# EAGLE design nucleo-block3-a-1 (EAGLE 9.6.2)
AUTHOR: Balazs Racz; DRAWING_TITLE: MEB Schalterwerk Projekt; LICENSE: Licensed by the Solderpad Hardware License V2.0; REVIEWER: n/a; REVISION: A2; YEAR: 2023
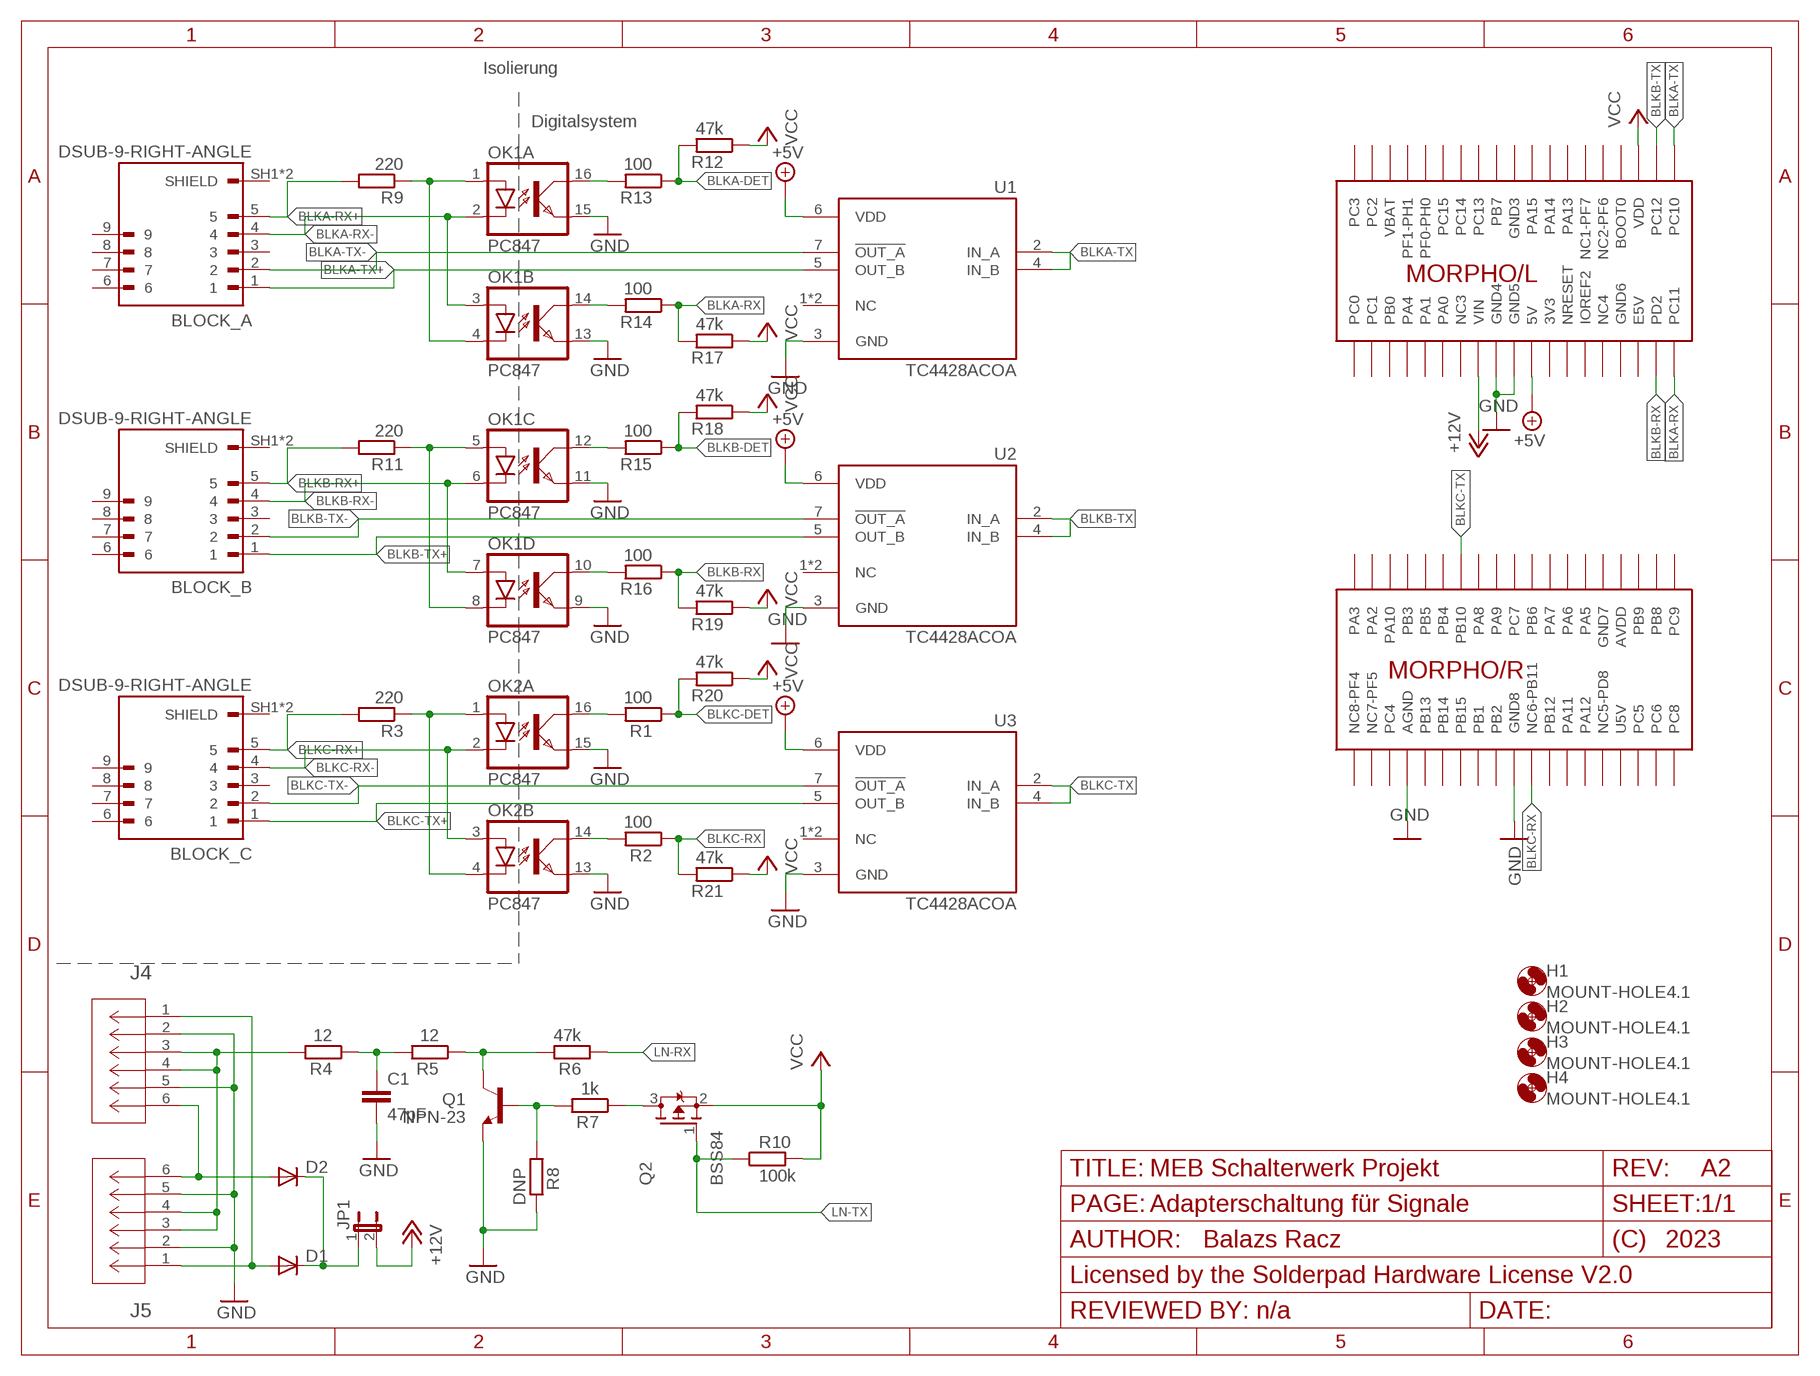
[diagram p0: schematic, sheet 1]
FRAME1 (FRAME_A_L): PAGE: Input ports
FRAME2 (FRAME_A_L): PAGE: Adapterschaltung für Signale

## Parts
BLOCK_A  DSUB-9-RIGHT-ANGLE  [ASSMANN_A-DS_09_A_KG-T2S]
BLOCK_B  DSUB-9-RIGHT-ANGLE  [ASSMANN_A-DS_09_A_KG-T2S]
BLOCK_C  DSUB-9-RIGHT-ANGLE  [ASSMANN_A-DS_09_A_KG-T2S]
C1  47pF  C-EUC0805  [C0805]
D1  DIODEDO-214AA-NODOC  [DO214AA-NODOC]
D2  DIODEDO-214AA-NODOC  [DO214AA-NODOC]
G1  NUCLEO_64_GENERIC  [NUCLEO_BRD_BASE64]
H1  MOUNT-HOLE4.1  [4,1]
H2  MOUNT-HOLE4.1  [4,1]
H3  MOUNT-HOLE4.1  [4,1]
H4  MOUNT-HOLE4.1  [4,1]
J4  MODJACK6P6C-MJ3245-66-0CONN_MJ3245-66-0_GCT  [CONN_MJ3245-66-0_GCT]
J5  MODJACK6P6C-MJ3245-66-0CONN_MJ3245-66-0_GCT  [CONN_MJ3245-66-0_GCT]
JP1  JP1E  [JP1]
OK1  PC847  [DIL16]
OK2  PC847  [DIL16]
Q1  NPN-23  [SOT23]
Q2  BSS84  [SOT23-PCH]
R1  100  R-EU_R0805  [R0805]
R2  100  R-EU_R0805  [R0805]
R3  220  R-EU_R0805  [R0805]
R4  12  R-EU_R0805  [R0805]
R5  12  R-EU_R0805  [R0805]
R6  47k  R-EU_R0805  [R0805]
R7  1k  R-EU_R0805  [R0805]
R8  DNP  R-EU_R0805  [R0805]
R9  220  R-EU_R0805  [R0805]
R10  100k  R-EU_R0805  [R0805]
R11  220  R-EU_R0805  [R0805]
R12  47k  R-EU_R0805  [R0805]
R13  100  R-EU_R0805  [R0805]
R14  100  R-EU_R0805  [R0805]
R15  100  R-EU_R0805  [R0805]
R16  100  R-EU_R0805  [R0805]
R17  47k  R-EU_R0805  [R0805]
R18  47k  R-EU_R0805  [R0805]
R19  47k  R-EU_R0805  [R0805]
R20  47k  R-EU_R0805  [R0805]
R21  47k  R-EU_R0805  [R0805]
U1  TC4428ACOA  [SOIC127P600X175-8N]
U2  TC4428ACOA  [SOIC127P600X175-8N]
U3  TC4428ACOA  [SOIC127P600X175-8N]

## Nets
+5V: G1.5V2(5V) U1.6(VDD) U2.6(VDD) U3.6(VDD)
+12V: G1.VIN2(VIN) JP1.2
BLKA-DET: R12.2 R13.1
BLKA-RX: G1.PC11 R14.1 R17.2
BLKA-RX+: BLOCK_A.5 R9.2
BLKA-RX-: BLOCK_A.4 OK1.2(A:C) OK1.3(B:A)
BLKA-TX: G1.PC10 U1.2(IN_A) U1.4(IN_B)
BLKA-TX+: BLOCK_A.1 U1.5(OUT_B)
BLKA-TX-: BLOCK_A.2 U1.7(!OUT_A)
BLKB-DET: R15.1 R18.2
BLKB-RX: G1.PD2 R16.1 R19.2
BLKB-RX+: BLOCK_B.5 R11.2
BLKB-RX-: BLOCK_B.4 OK1.6(C:C) OK1.7(D:A)
BLKB-TX: G1.PC12 U2.2(IN_A) U2.4(IN_B)
BLKB-TX+: BLOCK_B.1 U2.5(OUT_B)
BLKB-TX-: BLOCK_B.2 U2.7(!OUT_A)
BLKC-DET: R1.1 R20.2
BLKC-RX: G1.NC6-PB11 R2.1 R21.2
BLKC-RX+: BLOCK_C.5 R3.2
BLKC-RX-: BLOCK_C.4 OK2.2(A:C) OK2.3(B:A)
BLKC-TX: G1.PB10 U3.2(IN_A) U3.4(IN_B)
BLKC-TX+: BLOCK_C.1 U3.5(OUT_B)
BLKC-TX-: BLOCK_C.2 U3.7(!OUT_A)
GND: C1.2 G1.AGND G1.GND4 G1.GND5 G1.GND8 J4.2 J4.5 J5.2 J5.5 OK1.9(D:EMIT) OK1.11(C:EMIT) OK1.13(B:EMIT) OK1.15(A:EMIT) OK2.13(B:EMIT) OK2.15(A:EMIT) Q1.2(E) R8.2 U1.3(GND) U2.3(GND) U3.3(GND)
LN-RX: R6.1
LN-TX: Q2.1(G) R10.1
N$1: OK2.1(A:A) OK2.4(B:C) R3.1
N$2: OK2.16(A:COL) R1.2
N$3: OK2.14(B:COL) R2.2
N$4: D2.A J4.6 J5.6
N$5: C1.1 R4.1 R5.2
N$6: D1.A J4.1 J5.1
N$7: J4.3 J4.4 J5.3 J5.4 R4.2
N$8: D1.C D2.C JP1.1
N$9: Q1.3(C) R5.1 R6.2
N$10: Q2.3(D) R7.1
N$11: Q1.1(B) R7.2 R8.1
N$31: OK1.1(A:A) OK1.4(B:C) R9.1
N$35: OK1.5(C:A) OK1.8(D:C) R11.1
N$41: OK1.16(A:COL) R13.2
N$42: OK1.14(B:COL) R14.2
N$43: OK1.12(C:COL) R15.2
N$44: OK1.10(D:COL) R16.2
VCC: G1.VDD Q2.2(S) R10.2 R12.1 R17.1 R18.1 R19.1 R20.1 R21.1
Unconnected: BLOCK_A.3 BLOCK_A.6 BLOCK_A.7 BLOCK_A.8 BLOCK_A.9 BLOCK_A.SH1(SHIELD) BLOCK_A.SH2(SHIELD) BLOCK_B.3 BLOCK_B.6 BLOCK_B.7 BLOCK_B.8 BLOCK_B.9 BLOCK_B.SH1(SHIELD) BLOCK_B.SH2(SHIELD) BLOCK_C.3 BLOCK_C.6 BLOCK_C.7 BLOCK_C.8 BLOCK_C.9 BLOCK_C.SH1(SHIELD) BLOCK_C.SH2(SHIELD) G1.BOOT0 G1.IOREF2 G1.NC1-PF7 G1.NC2-PF6 G1.NC3 G1.NC4 G1.NC5-PD8 G1.NC7-PF5 G1.NC8-PF4 G1.NRESET G1.PA0 G1.PA1 G1.PA2 G1.PA3 G1.PA4 G1.PA5 G1.PA6 G1.PA7 G1.PA8 G1.PA9 G1.PA10 G1.PA11 G1.PA12 G1.PA13 G1.PA14 G1.PA15 G1.PB0 G1.PB1 G1.PB2 G1.PB3 G1.PB4 G1.PB5 G1.PB6 G1.PB7 G1.PB8 G1.PB9 G1.PB12 G1.PB13 G1.PB14 G1.PB15 G1.PC0 G1.PC1 G1.PC2 G1.PC3 G1.PC4 G1.PC5 G1.PC6 G1.PC7 G1.PC8 G1.PC9 G1.PC13 G1.PC14 G1.PC15 G1.PF0-PH0 G1.PF1-PH1 OK2.5(C:A) OK2.6(C:C) OK2.7(D:A) OK2.8(D:C) OK2.9(D:EMIT) OK2.10(D:COL) OK2.11(C:EMIT) OK2.12(C:COL) U1.1(NC) U1.8(NC) U2.1(NC) U2.8(NC) U3.1(NC) U3.8(NC)

## Notes on the sheet
- Isolierung
- Digitalsystem

## Power pins joined to a net without a drawn wire
3V3: G1.3V3
AVDD: G1.AVDD
E5V: G1.E5V
GND3: G1.GND3
GND6: G1.GND6
GND7: G1.GND7
U5V: G1.U5V
VBAT: G1.VBAT

## Library data of the parts
BLOCK_A BLOCK_B BLOCK_C = eagleparts:DSUB-9-RIGHT-ANGLE: A-DS_09_A_KG-T2S Female: digikey AE10921-ND Male: digikey AE10968-ND; MANUFACTURER: Assmann WSW Components; MAXIMUM_PACKAGE_HEIGHT: 12.8mm; PARTREV: 10; STANDARD: Manufacturer recommendations
C1 = rcl:C-EU: CAPACITOR, European symbol; SPICEPREFIX: C
D1 D2 = trainlib:DIODE
G1 = eagleparts:NUCLEO_64_GENERIC
H1-H4 = holes:MOUNT-HOLE: MOUNTING HOLE with drill center marker
J4 J5 = eagleparts:MODJACK6P6C-MJ3245-66-0: 6p6c modular jack digikey: 2073-MJ3245-66-0-ND; COPYRIGHT: Copyright (C) 2024 Ultra Librarian. All rights reserved.; MANUFACTURER_PART_NUMBER: MJ3245-66-0; MFR_NAME: Global Connector Technology; TYPE: Modular Connector Jacks
JP1 = jumper:JP1E: JUMPER
OK1 OK2 = optocoupler:PC847: SHARP OPTO COUPLER; OC_FARNELL: 9707735; OC_NEWARK: unknown
Q1 = eagleparts:NPN-23
Q2 = eagleparts:BSS84: P-CHANNEL MOS FET
R1-R21 = rcl:R-EU_: RESISTOR, European symbol; SPICEPREFIX: R
U1-U3 = eagleparts:TC4428ACOA: Low-Side Gate Driver IC Inverting, Non-Inverting 8-SOIC; MANUFACTURER: Microchip; MAXIMUM_PACKAGE_HEIGHT: 1.75 mm; PARTREV: J; STANDARD: IPC 7351B

## Board
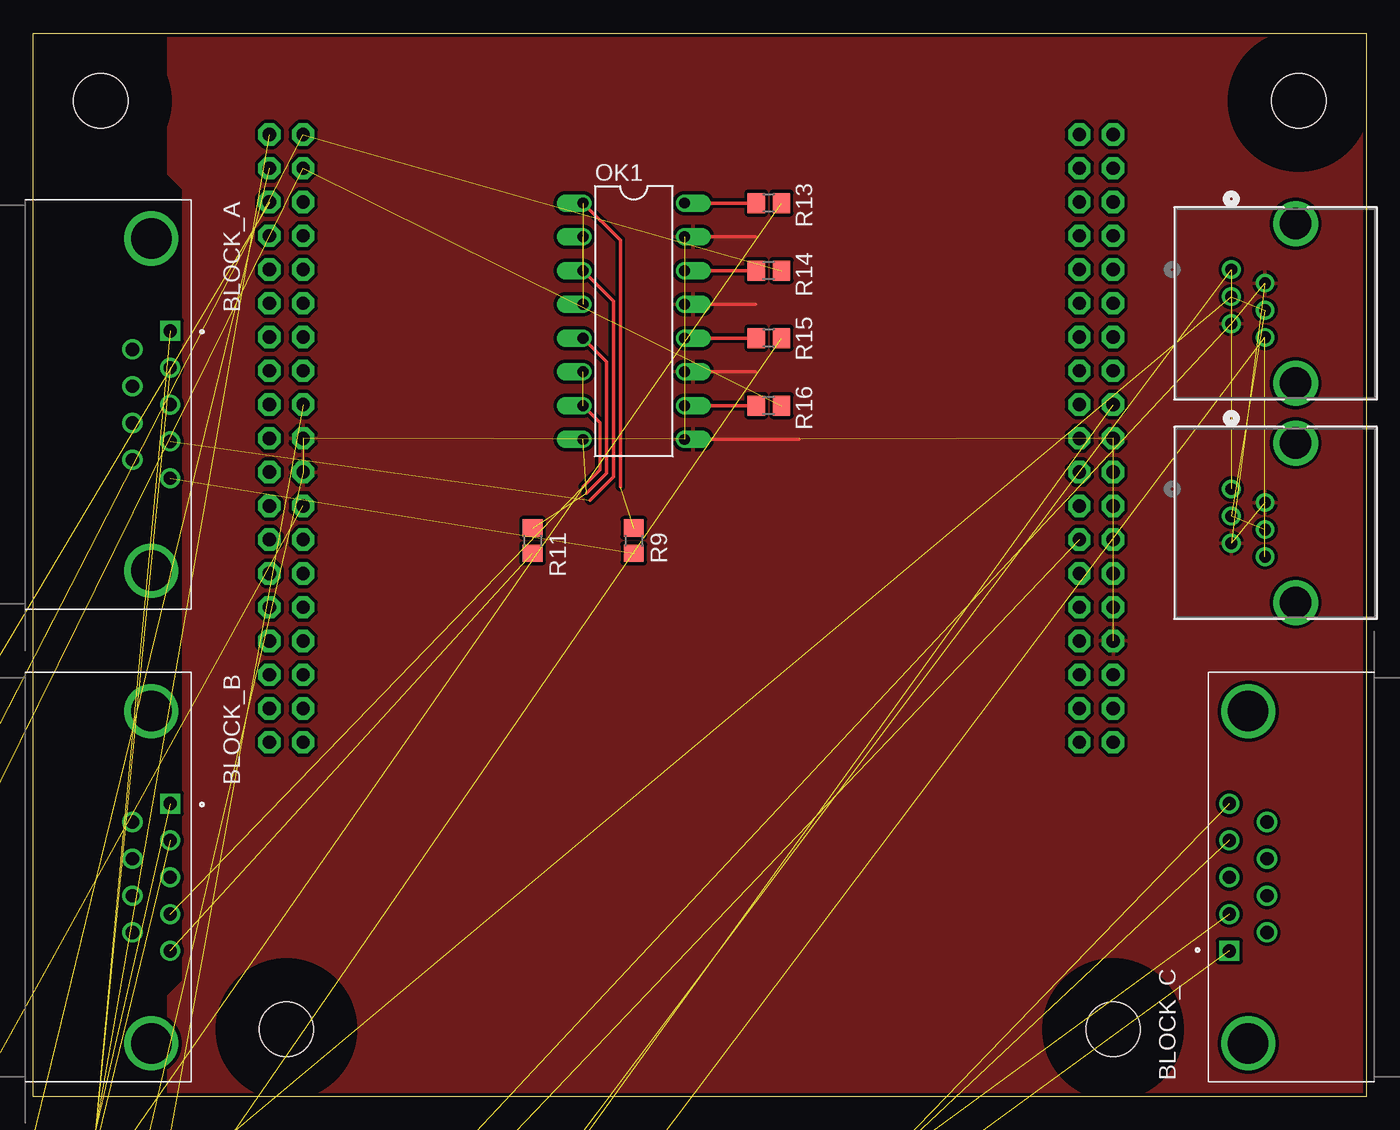
[diagram p1: board, top side]
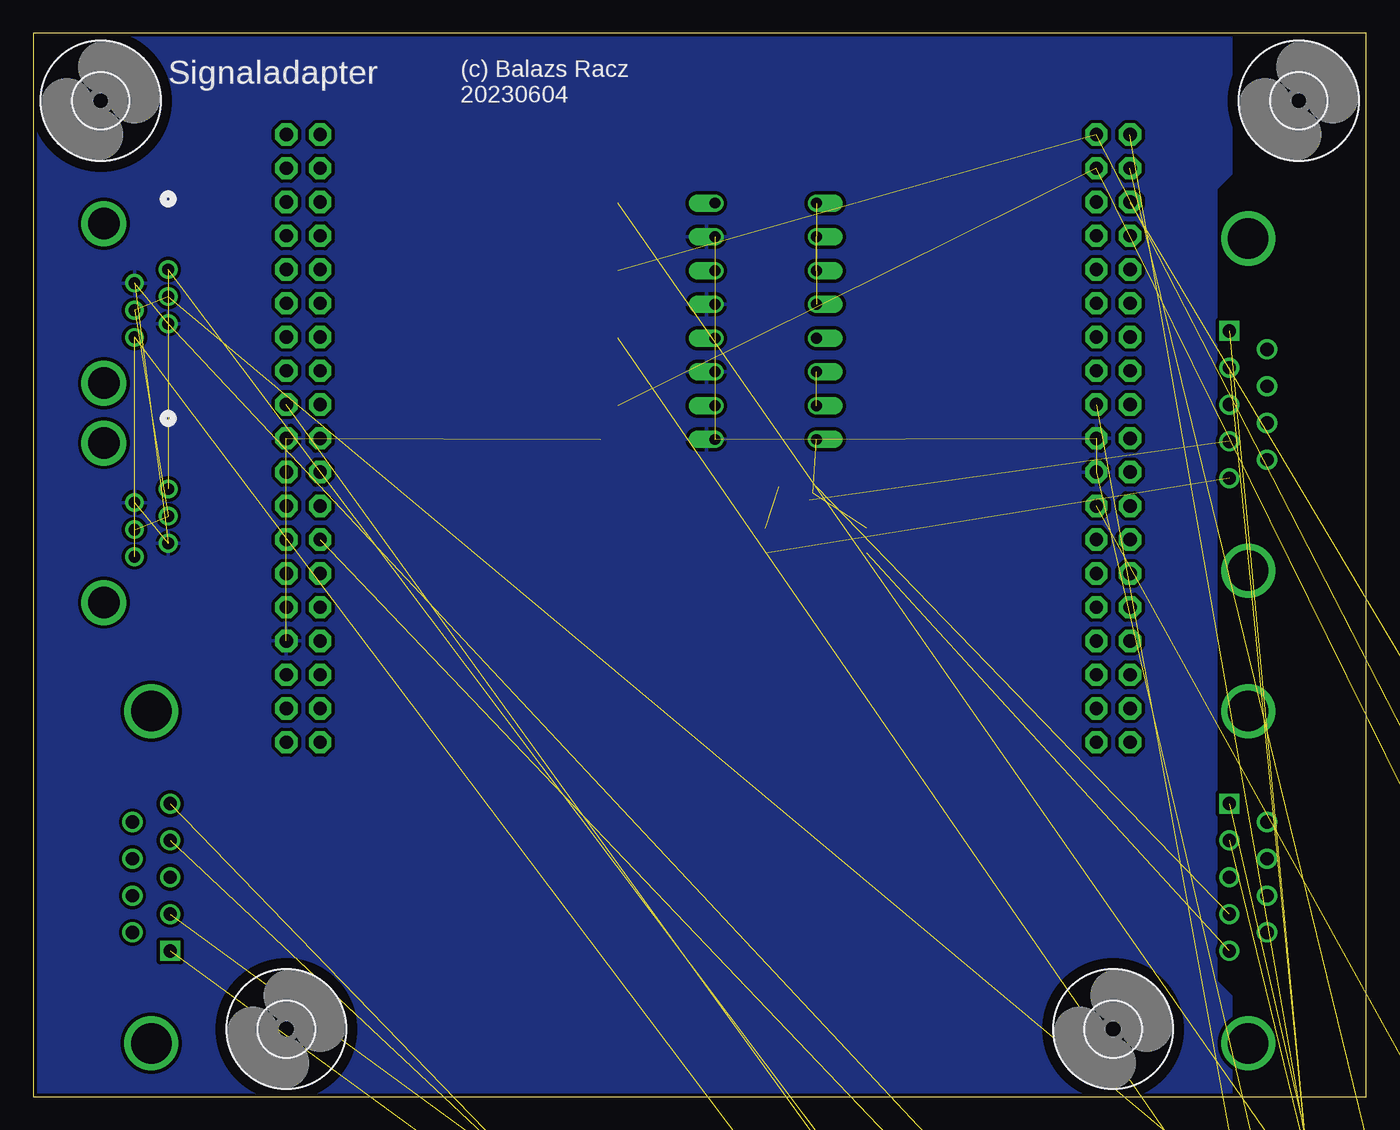
[diagram p2: board, bottom side, seen from below]

Size 100.33 x 80.01 mm. Coordinates in mm from the lower left corner, seen from the top.
Outline: 100.33,0 0,0 0,80.01 100.33,80 100.33,0
Copper layers (1*16): Top 0.035mm / dielectric 1.5mm / Bottom 0.035mm
Design rules "SeeedStudio_2layer_DRU_no_angle_20140221": minimum track width 6mil, minimum drill 12mil, track to track 6mil, track to pad 6mil, pad to pad 6mil, via to via 6mil, smd to smd 0mil, copper to edge 10mil, drill to drill 10mil, minimum pad ring 10mil, minimum via ring 6mil, stop-mask expansion 2mil, vias tented up to drill 100mil, thermal gap 10mil

### Footprints (pad centres in the part's own frame; a part is rotated, then mirrored left to right if it is on the bottom)
ASSMANN_A-DS_09_A_KG-T2S = drill 1 square: 1 -5.54,1.42 | drill 1: 2 -2.77,1.42; 3 0,1.42; 4 2.77,1.42; 5 5.54,1.42; 6 -4.155,-1.42; 7 -1.385,-1.42; 8 1.385,-1.42; 9 4.155,-1.42 | drill 3.05: SH1 -12.495,0; SH2 12.495,0
C0805 = smd 1.3 x 1.5: 1 -0.95,0; 2 0.95,0
DO214AA-NODOC = smd 1.8 x 2.2: A 2.55,0; C -2.55,0
NUCLEO_BRD_BASE64 = drill 1 pad 1.676 octagon: 3V3 2.54,27.94; 5V2 2.54,25.4; AGND 63.5,7.62; AVDD 60.96,38.1; BOOT0 0,38.1; E5V 2.54,40.64; GND3 0,22.86; GND4 2.54,20.32; GND5 2.54,22.86; GND6 2.54,38.1; GND7 60.96,35.56; GND8 63.5,22.86; IOREF2 2.54,33.02; NC1-PF7 0,33.02; NC2-PF6 0,35.56; NC3 2.54,15.24; NC4 2.54,35.56; NC5-PD8 63.5,35.56; NC6-PB11 63.5,25.4; NC7-PF5 63.5,2.54; NC8-PF4 63.5,0; NRESET 2.54,30.48; PA0 2.54,12.7; PA1 2.54,10.16; PA2 60.96,2.54; PA3 60.96,0; PA4 2.54,7.62; PA5 60.96,33.02; PA6 60.96,30.48; PA7 60.96,27.94; PA8 60.96,17.78; PA9 60.96,20.32; PA10 60.96,5.08; PA11 63.5,30.48; PA12 63.5,33.02; PA13 0,30.48; PA14 0,27.94; PA15 0,25.4; PB0 2.54,5.08; PB1 63.5,17.78; PB2 63.5,20.32; PB3 60.96,7.62; PB4 60.96,12.7; PB5 60.96,10.16; PB6 60.96,25.4; PB7 0,20.32; PB8 60.96,43.18; PB9 60.96,40.64; PB10 60.96,15.24; PB12 63.5,27.94; PB13 63.5,10.16; PB14 63.5,12.7; PB15 63.5,15.24; PC0 2.54,0; PC1 2.54,2.54; PC2 0,2.54; PC3 0,0; PC4 63.5,5.08; PC5 63.5,40.64; PC6 63.5,43.18; PC7 60.96,22.86; PC8 63.5,45.72; PC9 60.96,45.72; PC10 0,45.72; PC11 2.54,45.72; PC12 0,43.18; PC13 0,17.78; PC14 0,15.24; PC15 0,12.7; PD2 2.54,43.18; PF0-PH0 0,10.16; PF1-PH1 0,7.62; U5V 63.5,38.1; VBAT 0,5.08; VDD 0,40.64; VIN2 2.54,17.78
4,1 = hole 4.1: 0,0
CONN_MJ3245-66-0_GCT = drill 0.889 pad 1.397: 1 0,0; 2 -1.02,-2.54; 3 -2.04,0; 4 -3.06,-2.54; 5 -4.08,0; 6 -5.1,-2.54 | drill 2.362 pad 2.362: 7 -8.55,-4.84; 8 3.45,-4.84
JP1 = drill 0.914 long: 1 0,-1.27; 2 0,1.27
DIL16 = drill 0.813 offset: 1 -8.89,-3.81; 2 -6.35,-3.81; 3 -3.81,-3.81; 4 -1.27,-3.81; 5 1.27,-3.81; 6 3.81,-3.81; 7 6.35,-3.81; 8 8.89,-3.81; 9 8.89,3.81; 10 6.35,3.81; 11 3.81,3.81; 12 1.27,3.81; 13 -1.27,3.81; 14 -3.81,3.81; 15 -6.35,3.81; 16 -8.89,3.81
SOT23 = smd 1 x 1.4: 1 -0.95,-1.1; 2 0.95,-1.1; 3 0,1.1
SOT23-PCH = smd 1 x 1.4: 1 -0.95,-1.1; 2 0.95,-1.1; 3 0,1.1
R0805 = smd 1.3 x 1.5: 1 -0.95,0; 2 0.95,0
SOIC127P600X175-8N = smd 1.9 x 0.6: 1 -2.455,1.905; 2 -2.455,0.635; 3 -2.455,-0.635; 4 -2.455,-1.905; 5 2.455,-1.905; 6 2.455,-0.635; 7 2.455,0.635; 8 2.455,1.905

### Placement (x,y rotation side)
BLOCK_A  8.89,52.07 270 top
BLOCK_B  8.89,16.51 270 top
BLOCK_C  91.44,16.51 90 top
C1  -104.14,-114.3 0 top  (outside the outline)
D1  -109.22,-199.39 0 top  (outside the outline)
D2  -109.22,-207.01 0 top  (outside the outline)
G1  17.78,26.67 0 top
H1  5.08,74.93 0 bottom
H2  19.05,5.08 0 bottom
H3  81.28,5.08 0 bottom
H4  95.25,74.93 0 bottom
J4  90.17,62.23 90 top
J5  90.17,45.72 90 top
JP1  -110.49,-193.04 0 top  (outside the outline)
OK1  45.2,58.34 270 top
OK2  -14,-78 0 top  (outside the outline)
Q1  -104.14,-119.38 0 top  (outside the outline)
Q2  -104.14,-134.62 0 top  (outside the outline)
R1  -24,-88 0 top  (outside the outline)
R2  -19,-88 0 top  (outside the outline)
R3  -24,-95 0 top  (outside the outline)
R4  -104.14,-101.6 0 top  (outside the outline)
R5  -104.14,-107.95 0 top  (outside the outline)
R6  -104.14,-127 0 top  (outside the outline)
R7  -104.14,-142.24 0 top  (outside the outline)
R8  -104.14,-148.59 0 top  (outside the outline)
R9  45.2,41.83 270 top
R10  -104.14,-154.94 0 top  (outside the outline)
R11  37.58,41.83 270 top
R12  -104.14,-161.29 0 top  (outside the outline)
R13  55.36,67.23 180 top
R14  55.36,62.15 180 top
R15  55.36,57.07 180 top
R16  55.36,51.99 180 top
R17  -104.14,-167.64 0 top  (outside the outline)
R18  -104.14,-173.99 0 top  (outside the outline)
R19  -104.14,-180.34 0 top  (outside the outline)
R20  -104.14,-186.69 0 top  (outside the outline)
R21  -104.14,-193.04 0 top  (outside the outline)
U1  -4,-67 0 top  (outside the outline)
U2  -13,-67 0 top  (outside the outline)
U3  -22,-67 0 top  (outside the outline)

### Tracks (layer width: path | path; a pad name or v marks a point on that pad's centre or on a via)
+5V  (3 unrouted)
+12V  (1 unrouted)
BLKA-DET  (1 unrouted)
BLKA-RX  (2 unrouted)
BLKA-RX+  (1 unrouted)
BLKA-RX-  (2 unrouted)
  Top 0.254: 41.9,44.88 43.68,46.66 43.68,59.86 OK1.3
BLKA-TX  (2 unrouted)
BLKA-TX+  (1 unrouted)
BLKA-TX-  (1 unrouted)
BLKB-DET  (1 unrouted)
BLKB-RX  (2 unrouted)
BLKB-RX+  (1 unrouted)
BLKB-RX-  (2 unrouted)
  Top 0.254: 41.39,45.89 42.66,47.16 42.66,50.72 OK1.7
BLKB-TX  (2 unrouted)
BLKB-TX+  (1 unrouted)
BLKB-TX-  (1 unrouted)
BLKC-DET  (1 unrouted)
BLKC-RX  (2 unrouted)
BLKC-RX+  (1 unrouted)
BLKC-RX-  (2 unrouted)
BLKC-TX  (2 unrouted)
BLKC-TX+  (1 unrouted)
BLKC-TX-  (1 unrouted)
GND  (19 unrouted)
  Top 0.254: OK1.15 54.34,64.69 | OK1.13 54.34,59.61 | OK1.11 54.34,54.53 | 57.65,49.45 OK1.9
  pour Bottom (isolate 0.254): 100.08,79.76 100.08,0.25 10.08,0.25 10.08,7.54 11.21,8.67 11.21,68.29 10.08,69.42 10.08,79.76
  pour Top (isolate 0.254): 100.08,0.25 100.08,79.76 10.08,79.76 10.08,69.42 11.21,68.29 11.21,8.67 10.08,7.54 10.08,0.25
LN-TX  (1 unrouted)
N$1  (2 unrouted)
N$2  (1 unrouted)
N$3  (1 unrouted)
N$4  (2 unrouted)
N$5  (2 unrouted)
N$6  (2 unrouted)
N$7  (4 unrouted)
N$8  (2 unrouted)
N$9  (2 unrouted)
N$10  (1 unrouted)
N$11  (2 unrouted)
N$31  (2 unrouted)
  Top 0.254: 44.18,45.89 44.18,64.44 OK1.1
N$35  (2 unrouted)
  Top 0.254: 41.64,45.39 43.17,46.91 43.17,55.29 OK1.5
N$41
  Top 0.254: R13.2 OK1.16
N$42
  Top 0.254: R14.2 OK1.14
N$43
  Top 0.254: R15.2 OK1.12
N$44
  Top 0.254: R16.2 OK1.10
VCC  (8 unrouted)

### Text on the board
bNames: Signaladapter | (c) Balazs Racz / 20230604 | F1 / RM | ora/w| | Masse | ora| | F2 / RM | gn/w| | Masse | gn| | bl| | H / RM | bl/w| | br/w| | br|